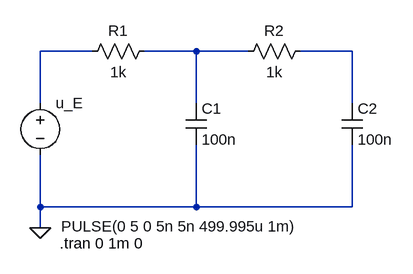
[diagram p0: schematic 3_Simulation.asc]
3_Simulation.asc, the LTspice schematic file:
Version 4
SHEET 1 880 680
WIRE 16 16 -64 16
WIRE 176 16 96 16
WIRE 256 16 176 16
WIRE 416 16 336 16
WIRE -64 96 -64 16
WIRE 176 96 176 16
WIRE 416 96 416 16
WIRE -64 256 -64 176
WIRE 176 256 176 160
WIRE 176 256 -64 256
WIRE 416 256 416 160
WIRE 416 256 176 256
WIRE -64 288 -64 256
FLAG -64 288 0
SYMBOL res 0 32 R270
WINDOW 0 32 56 VTop 2
WINDOW 3 0 56 VBottom 2
SYMATTR InstName R1
SYMATTR Value 1k
SYMBOL res 240 32 R270
WINDOW 0 32 56 VTop 2
WINDOW 3 0 56 VBottom 2
SYMATTR InstName R2
SYMATTR Value 1k
SYMBOL cap 160 96 R0
SYMATTR InstName C1
SYMATTR Value 100n
SYMBOL cap 400 96 R0
SYMATTR InstName C2
SYMATTR Value 100n
SYMBOL voltage -64 80 R0
WINDOW 3 32 206 Left 2
WINDOW 123 0 0 Left 2
WINDOW 39 0 0 Left 2
SYMATTR InstName u_E
SYMATTR Value PULSE(0 5 0 5n 5n 499.995u 1m)
TEXT -34 312 Left 2 !.tran 0 1m 0

The netlist it stands for:
* 3_Simulation.asc
R1 N001 N002 1k
R2 N002 N003 1k
C1 N002 0 100n
C2 N003 0 100n
V§u_E N001 0 PULSE(0 5 0 5n 5n 499.995u 1m)
.tran 0 1m 0
.backanno
.end